# EAGLE design untitled (EAGLE 9.6.2)
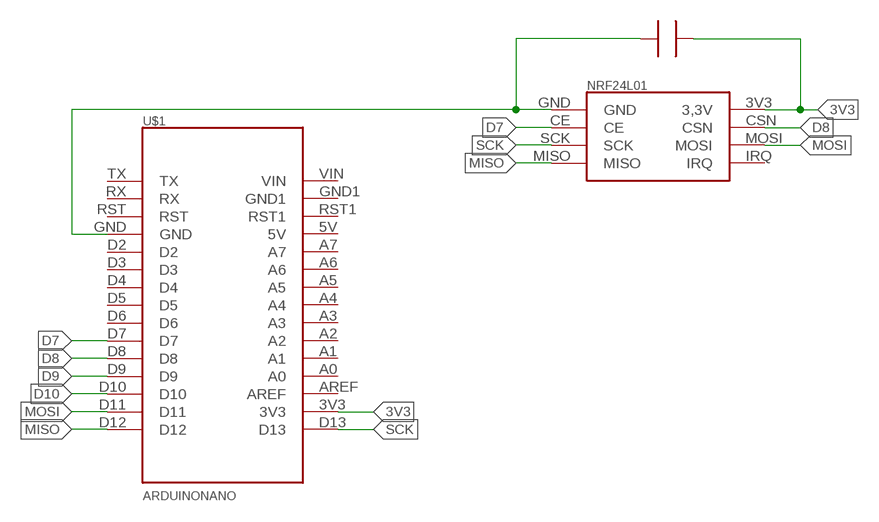
[diagram p0: schematic, sheet 1]

## Parts
U$1  ARDUINONANO  [ARDUINONANO]
U$2  C  [C]
U$3  NRF24L01  [NRF24L01]

## Nets
3V3: U$1.3V3 U$2.+ U$3.3V3(3,3V)
D7: U$1.D7 U$3.CE
D8: U$1.D8 U$3.CSN
D9: U$1.D9
D10: U$1.D10
MISO: U$1.D12 U$3.MISO
MOSI: U$1.D11 U$3.MOSI
N$2: U$1.GND U$2.- U$3.GND
SCK: U$1.D13 U$3.SCK
Unconnected: U$1.5V U$1.A0 U$1.A1 U$1.A2 U$1.A3 U$1.A4 U$1.A5 U$1.A6 U$1.A7 U$1.AREF U$1.D2 U$1.D3 U$1.D4 U$1.D5 U$1.D6 U$1.GND1 U$1.RST U$1.RST1 U$1.RX U$1.TX U$1.VIN U$3.IRQ

## Library data of the parts
U$1 = lib prueba cnc:ARDUINONANO
U$2 = lib prueba cnc:C
U$3 = Libreria banana leaf_V2:NRF24L01

## Board
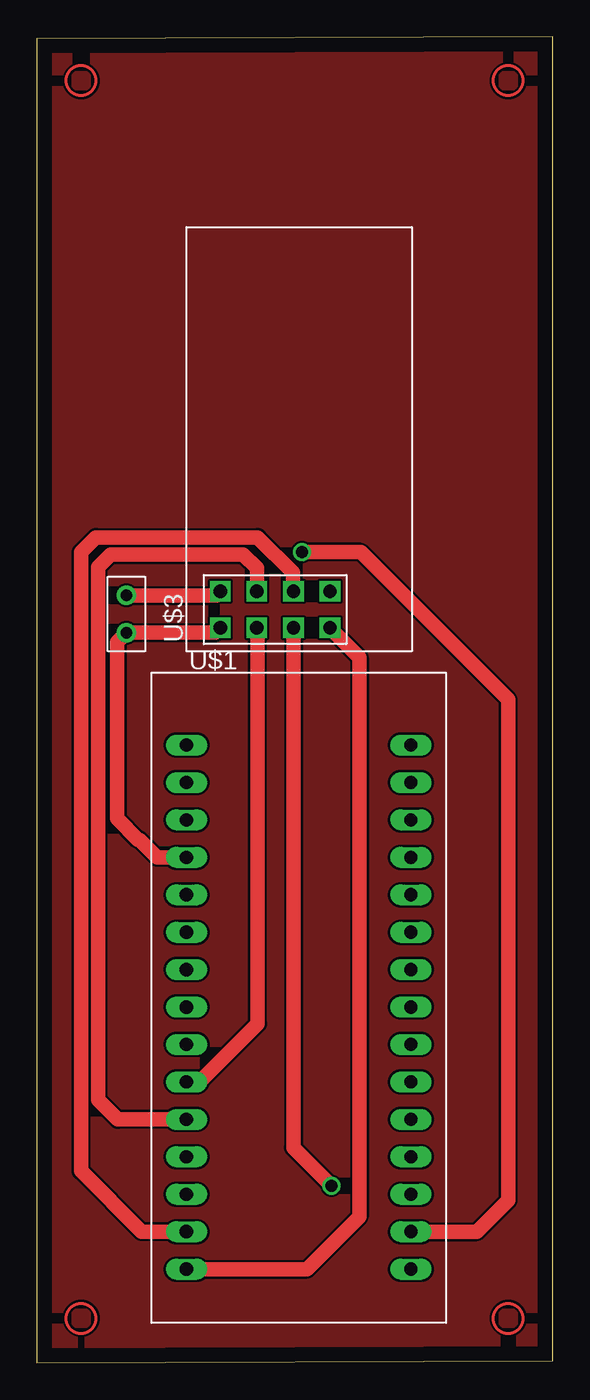
[diagram p1: board, top side]
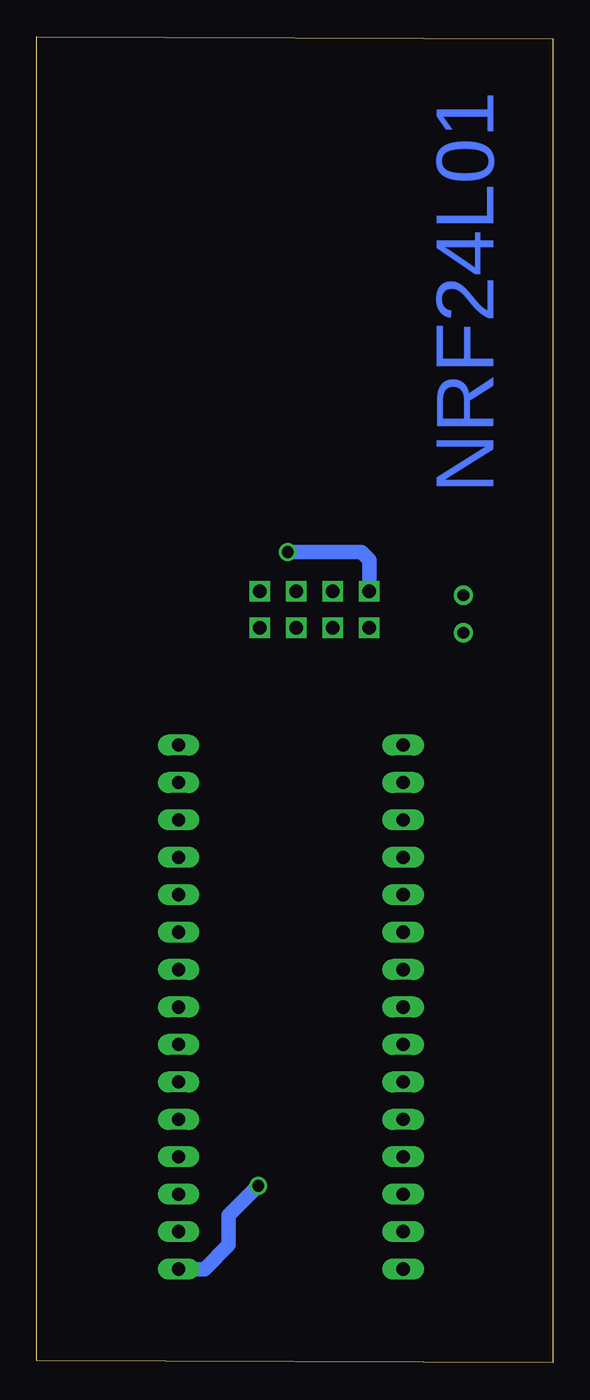
[diagram p2: board, bottom side, seen from below]

Size 35.03 x 89.97 mm. Coordinates in mm from the lower left corner, seen from the top.
Outline: 0,0 35.03,0.13 35.03,89.97 0,89.84 0,0
Copper layers (1*16): Top 0.035mm / dielectric 1.5mm / Bottom 0.035mm
Design rules "default": minimum track width 6mil, minimum drill 0.35mm, track to track 6mil, track to pad 6mil, pad to pad 6mil, via to via 6mil, smd to smd 6mil, copper to edge 40mil, drill to drill 6mil, minimum pad ring 10mil, minimum via ring 8mil, stop-mask expansion 4mil, vias tented up to drill 0mil, thermal gap 10mil

### Footprints (pad centres in the part's own frame; a part is rotated, then mirrored left to right if it is on the bottom)
ARDUINONANO = drill 0.9 pad 1.27 long: 3V3 7.62,-15.24; 5V 7.62,10.16; A0 7.62,-10.16; A1 7.62,-7.62; A2 7.62,-5.08; A3 7.62,-2.54; A4 7.62,0; A5 7.62,2.54; A6 7.62,5.08; A7 7.62,7.62; AREF 7.62,-12.7; D2 -7.62,7.62; D3 -7.62,5.08; D4 -7.62,2.54; D5 -7.62,0; D6 -7.62,-2.54; D7 -7.62,-5.08; D8 -7.62,-7.62; D9 -7.62,-10.16; D10 -7.62,-12.7; D11 -7.62,-15.24; D12 -7.62,-17.78; D13 7.62,-17.78; GND -7.62,10.16; GND1 7.62,15.24; RST -7.62,12.7; RST1 7.62,12.7; RX -7.62,15.24; TX -7.62,17.78; VIN 7.62,17.78
C = drill 0.8: + 0,0; - -2.54,0
NRF24L01 = drill 0.9 square: 3V3 4.08,-2.3; CE 1.6,-4.78; CSN 4.08,-4.78; GND 1.6,-2.3; IRQ 4.08,-9.74; MISO 1.6,-9.74; MOSI 4.08,-7.26; SCK 1.6,-7.26

### Placement (x,y rotation side)
U$1  17.78,24.13 0 top
U$2  6.08,52.07 90 top
U$3  10.16,48.26 90 top

### Tracks (layer width: path | path; a pad name or v marks a point on that pad's centre or on a via)
3V3  (via drill 0.8)
  Top 1: U$2.+ 12.19,52.07 U$3.3V3 | U$1.3V3 29.89,8.89 32,11 32,45 22,55 v18,55
  Bottom 1: v18,55 13,55 12.46,54.46 U$3.3V3
D7
  Top 1: U$1.D7 11.05,19.05 15,23 15,49.8 U$3.CE
D8
  Top 1: U$1.D8 5.49,16.51 4.15,17.85 4.15,54 5,54.85 14,54.85 14.94,53.91 U$3.CSN
GND
  pour Top: 0,0 35,0 35,90 1,90 0,89
MISO
  Top 1: U$1.D12 18.35,6.35 21.9,9.9 21.9,47.86 U$3.MISO
MOSI
  Top 1: U$1.D11 7.11,8.89 3,13 3,55 4,56 15,56 17.38,53.62 17.38,52.38 U$3.MOSI
N$2
  Top 1: U$3.GND 12.13,49.53 U$2.- 5.45,48.9 5.45,36.92 6.89,35.47 6.98,35.47 8.16,34.29 U$1.GND
SCK  (via drill 0.8)
  Top 1: U$3.SCK 17.42,14.58 v20,12
  Bottom 1: v20,12 22,10 22,8 23.65,6.35 U$1.D13
(copper drawn outside any net)
  shapes: Top circle x4

### Text on the board
Bottom: NRF24L01